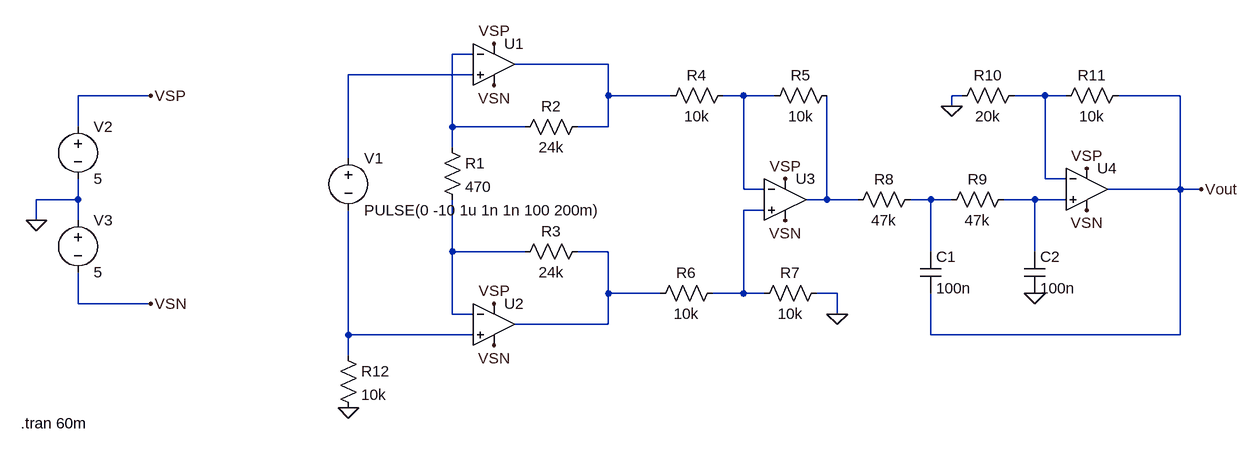
[diagram p0: schematic ex4.asc]
ex4.asc, the LTspice schematic file:
Version 4
SHEET 1 1880 740
WIRE 688 112 656 112
WIRE 896 128 752 128
WIRE 688 144 496 144
WIRE 192 176 80 176
WIRE 896 176 896 128
WIRE 992 176 896 176
WIRE 1104 176 1072 176
WIRE 1152 176 1104 176
WIRE 1440 176 1424 176
WIRE 1568 176 1520 176
WIRE 1600 176 1568 176
WIRE 1776 176 1680 176
WIRE 1424 192 1424 176
WIRE 80 224 80 176
WIRE 656 224 656 112
WIRE 768 224 656 224
WIRE 896 224 896 176
WIRE 896 224 848 224
WIRE 656 256 656 224
WIRE 496 272 496 144
WIRE 1568 304 1568 176
WIRE 1600 304 1568 304
WIRE 1104 320 1104 176
WIRE 1136 320 1104 320
WIRE 1776 320 1776 176
WIRE 1776 320 1664 320
WIRE 1808 320 1776 320
WIRE 80 336 80 304
WIRE 80 336 16 336
WIRE 1232 336 1232 176
WIRE 1232 336 1200 336
WIRE 1280 336 1232 336
WIRE 1392 336 1360 336
WIRE 1424 336 1392 336
WIRE 1552 336 1504 336
WIRE 1600 336 1552 336
WIRE 1136 352 1104 352
WIRE 16 368 16 336
WIRE 80 368 80 336
WIRE 656 416 656 336
WIRE 768 416 656 416
WIRE 896 416 848 416
WIRE 1392 416 1392 336
WIRE 1552 416 1552 336
WIRE 896 480 896 416
WIRE 976 480 896 480
WIRE 1104 480 1104 352
WIRE 1104 480 1056 480
WIRE 1136 480 1104 480
WIRE 1248 480 1216 480
WIRE 80 496 80 448
WIRE 192 496 80 496
WIRE 656 512 656 416
WIRE 688 512 656 512
WIRE 1248 512 1248 480
WIRE 896 528 896 480
WIRE 896 528 752 528
WIRE 496 544 496 352
WIRE 688 544 496 544
WIRE 1392 544 1392 480
WIRE 1776 544 1776 320
WIRE 1776 544 1392 544
WIRE 496 576 496 544
FLAG 16 368 0
FLAG 1248 512 0
FLAG 1552 480 0
FLAG 1424 192 0
FLAG 1808 320 Vout
FLAG 496 656 0
FLAG 192 176 VSP
FLAG 720 96 VSP
FLAG 720 496 VSP
FLAG 1168 304 VSP
FLAG 1632 288 VSP
FLAG 192 496 VSN
FLAG 720 560 VSN
FLAG 720 160 VSN
FLAG 1168 368 VSN
FLAG 1632 352 VSN
SYMBOL voltage 496 256 R0
WINDOW 123 24 118 Left 2
WINDOW 39 0 0 Left 0
SYMATTR InstName V1
SYMATTR Value PULSE(0 -10 1u 1n 1n 100 200m)
SYMBOL voltage 80 208 R0
WINDOW 123 0 0 Left 0
WINDOW 39 24 124 Left 2
SYMATTR InstName V2
SYMATTR Value 5
SYMBOL voltage 80 352 R0
WINDOW 123 0 0 Left 0
WINDOW 39 0 0 Left 0
SYMATTR InstName V3
SYMATTR Value 5
SYMBOL res 640 240 R0
SYMATTR InstName R1
SYMATTR Value 470
SYMBOL res 864 208 R90
WINDOW 0 0 56 VBottom 2
WINDOW 3 32 56 VTop 2
SYMATTR InstName R2
SYMATTR Value 24k
SYMBOL res 864 400 R90
WINDOW 0 0 56 VBottom 2
WINDOW 3 32 56 VTop 2
SYMATTR InstName R3
SYMATTR Value 24k
SYMBOL UniversalOpAmp2 720 128 R0
SYMATTR InstName U1
SYMBOL UniversalOpAmp2 720 528 R0
SYMATTR InstName U2
SYMBOL res 1088 160 R90
WINDOW 0 0 56 VBottom 2
WINDOW 3 32 56 VTop 2
SYMATTR InstName R4
SYMATTR Value 10k
SYMBOL res 1248 160 R90
WINDOW 0 0 56 VBottom 2
WINDOW 3 32 56 VTop 2
SYMATTR InstName R5
SYMATTR Value 10k
SYMBOL res 1072 464 R90
WINDOW 0 0 56 VBottom 2
WINDOW 3 32 56 VTop 2
SYMATTR InstName R6
SYMATTR Value 10k
SYMBOL res 1232 464 R90
WINDOW 0 0 56 VBottom 2
WINDOW 3 32 56 VTop 2
SYMATTR InstName R7
SYMATTR Value 10k
SYMBOL UniversalOpAmp2 1168 336 R0
SYMATTR InstName U3
SYMBOL res 1376 320 R90
WINDOW 0 0 56 VBottom 2
WINDOW 3 32 56 VTop 2
SYMATTR InstName R8
SYMATTR Value 47k
SYMBOL res 1520 320 R90
WINDOW 0 0 56 VBottom 2
WINDOW 3 32 56 VTop 2
SYMATTR InstName R9
SYMATTR Value 47k
SYMBOL res 1536 160 R90
WINDOW 0 0 56 VBottom 2
WINDOW 3 32 56 VTop 2
SYMATTR InstName R10
SYMATTR Value 20k
SYMBOL res 1696 160 R90
WINDOW 0 0 56 VBottom 2
WINDOW 3 32 56 VTop 2
SYMATTR InstName R11
SYMATTR Value 10k
SYMBOL cap 1376 416 R0
SYMATTR InstName C1
SYMATTR Value 100n
SYMBOL cap 1536 416 R0
SYMATTR InstName C2
SYMATTR Value 100n
SYMBOL UniversalOpAmp2 1632 320 R0
SYMATTR InstName U4
SYMBOL res 480 560 R0
SYMATTR InstName R12
SYMATTR Value 10k
TEXT -8 680 Left 2 !.tran 60m

The netlist it stands for:
* ex4.asc
V1 N003 N012 PULSE(0 -10 1u 1n 1n 100 200m)
V2 VSP 0 5
V3 0 VSN 5
R1 N001 N010 470
R2 N002 N001 24k
R3 N011 N010 24k
XU1 N003 N001 VSP VSN N002 level2 Avol=1Meg GBW=10Meg Slew=10Meg Ilimit=25m Rail=0 Vos=0 En=0 Enk=0 In=0 Ink=0 Rin=500Meg  ; pins In+ In- V+ V- OUT
XU2 N012 N010 VSP VSN N011 level2 Avol=1Meg GBW=10Meg Slew=10Meg Ilimit=25m Rail=0 Vos=0 En=0 Enk=0 In=0 Ink=0 Rin=500Meg  ; pins In+ In- V+ V- OUT
R4 N004 N002 10k
R5 N006 N004 10k
R6 N009 N011 10k
R7 0 N009 10k
XU3 N009 N004 VSP VSN N006 level2 Avol=1Meg GBW=10Meg Slew=10Meg Ilimit=25m Rail=0 Vos=0 En=0 Enk=0 In=0 Ink=0 Rin=500Meg  ; pins In+ In- V+ V- OUT
R8 N007 N006 47k
R9 N008 N007 47k
R10 N005 0 20k
R11 Vout N005 10k
C1 N007 Vout 100n
C2 N008 0 100n
XU4 N008 N005 VSP VSN Vout level2 Avol=1Meg GBW=10Meg Slew=10Meg Ilimit=25m Rail=0 Vos=0 En=0 Enk=0 In=0 Ink=0 Rin=500Meg  ; pins In+ In- V+ V- OUT
R12 N012 0 10k
.tran 60m
.lib UniversalOpAmp2.lib
.backanno
.end